# EAGLE design NV08C_GPS_shield_v1.1_reduced (EAGLE 6.4)
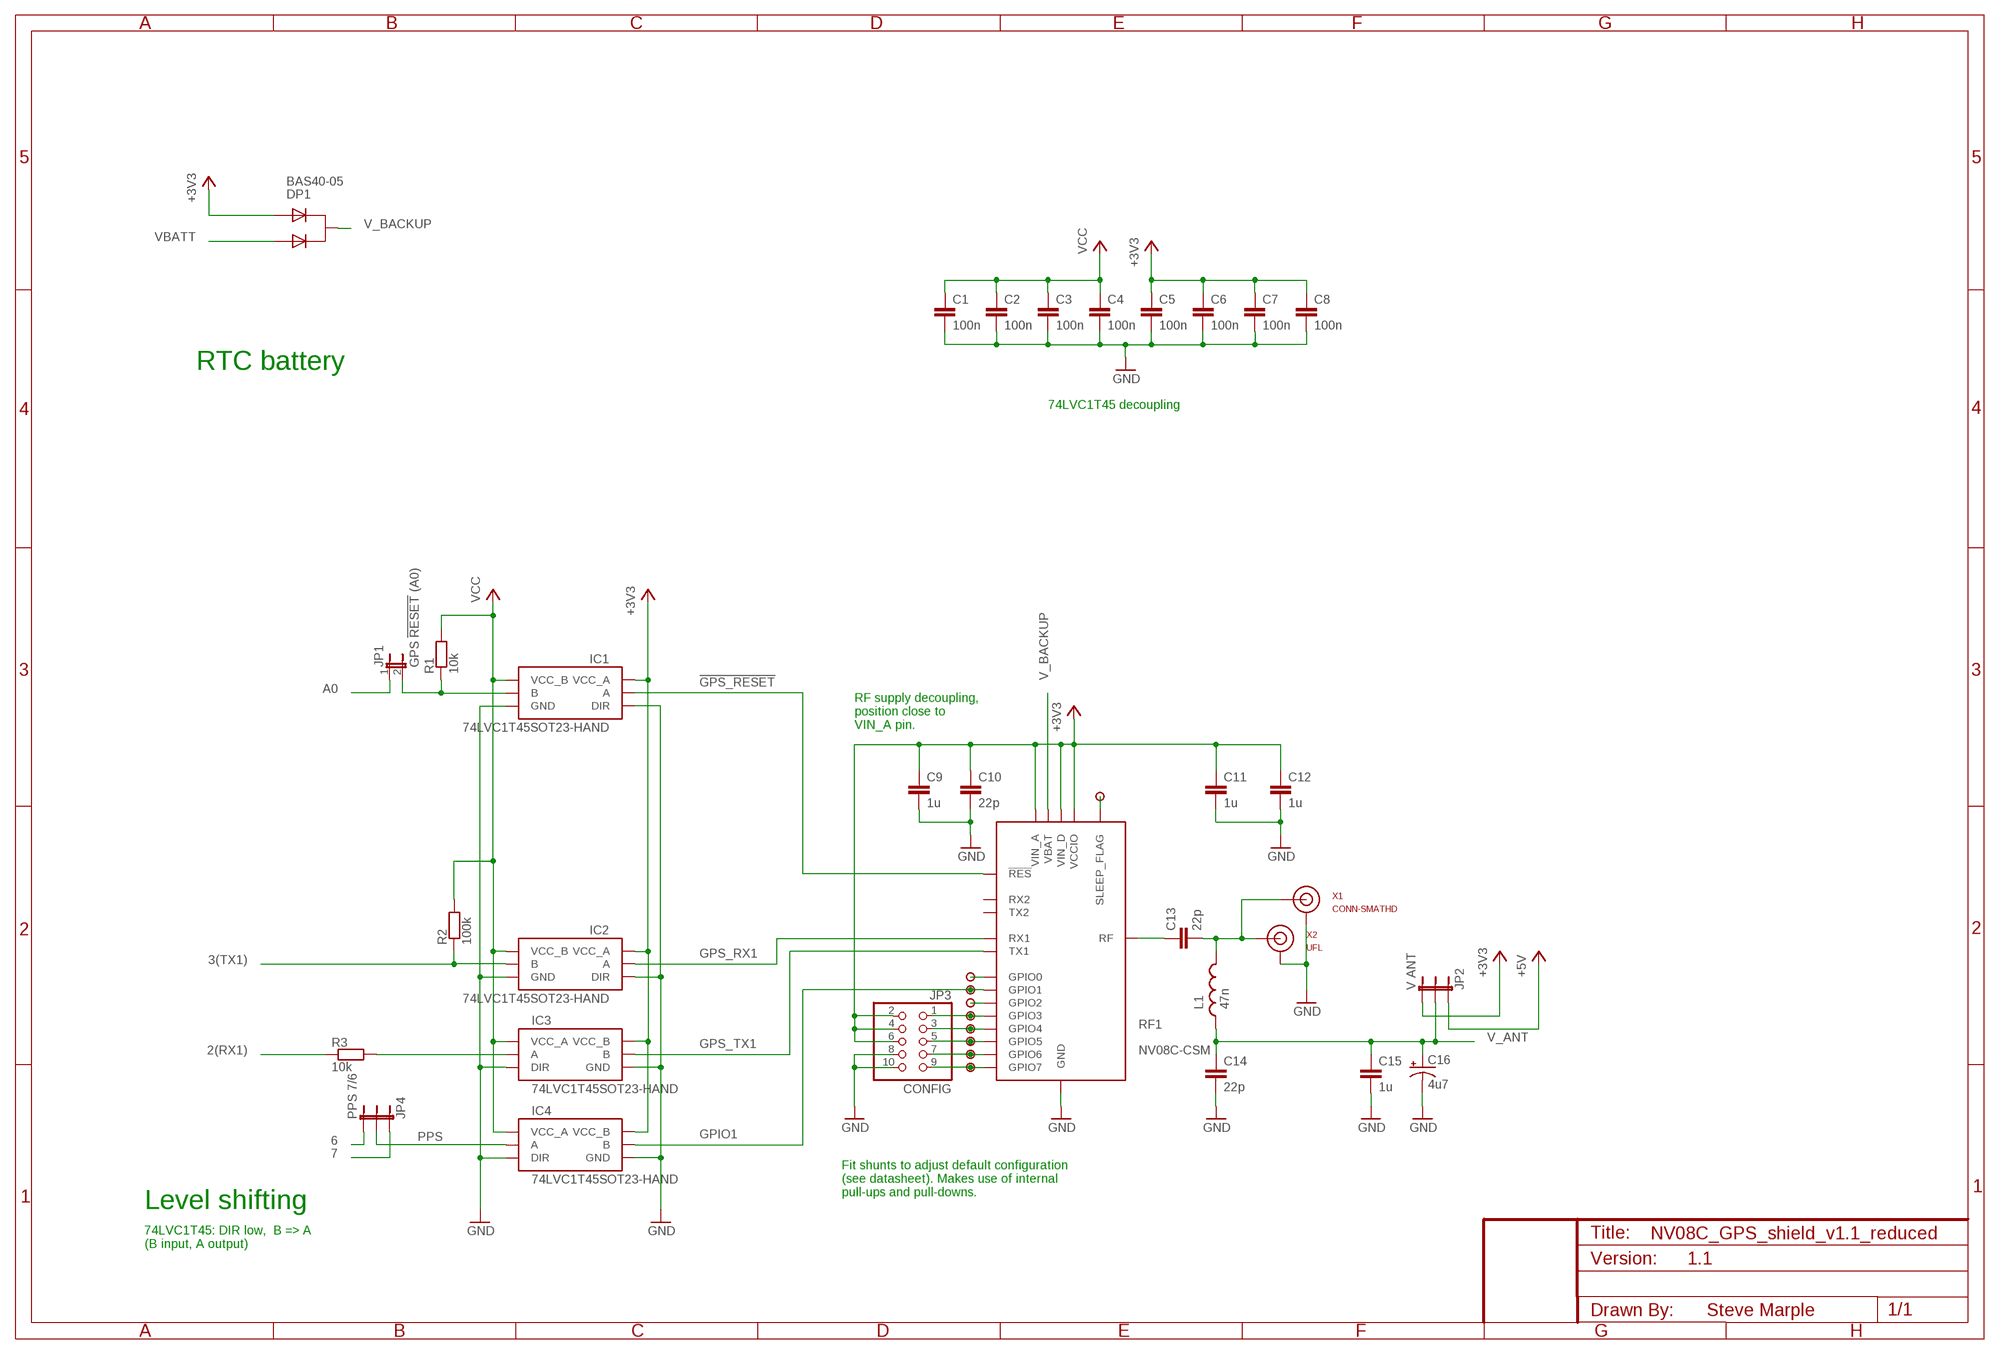
[diagram p0: schematic, sheet 1]

## Parts
C1  100n  C-EU1206-HAND  [1206-HAND]
C2  100n  C-EU1206-HAND  [1206-HAND]
C3  100n  C-EU1206-HAND  [1206-HAND]
C4  100n  C-EU1206-HAND  [1206-HAND]
C5  100n  C-EU1206-HAND  [1206-HAND]
C6  100n  C-EU1206-HAND  [1206-HAND]
C7  100n  C-EU1206-HAND  [1206-HAND]
C8  100n  C-EU1206-HAND  [1206-HAND]
C9  1u  C-EU1206-HAND  [1206-HAND]
C10  22p  C-EU0805-HAND  [0805-HAND]
C11  1u  C-EU1206-HAND  [1206-HAND]
C12  1u  C-EU1206-HAND  [1206-HAND]
C13  22p  C-EU0805-HAND  [0805-HAND]
C14  22p  C-EU0805-HAND  [0805-HAND]
C15  1u  C-EU1206-HAND  [1206-HAND]
C16  4u7  CAP_POLPTH2  [CPOL-RADIAL-10UF-25V]
DP1  BAS40-05  DIODE-PAIR-COMMON-CATHODE  [SOT23-3-HAND]
IC1  74LVC1T45SOT23-HAND  [SOT23-6-HAND]
IC2  74LVC1T45SOT23-HAND  [SOT23-6-HAND]
IC3  74LVC1T45SOT23-HAND  [SOT23-6-HAND]
IC4  74LVC1T45SOT23-HAND  [SOT23-6-HAND]
JP1  GPS !RESET! (A0)  JUMPER-2PTH  [1X02]
JP2  V ANT  JUMPER-3PTH  [1X03]
JP3  CONFIG  PINHD-2X5  [2X05]
JP4  PPS 7/6  JUMPER-3PTH  [1X03]
L1  47n  INDUCTOR0805-HAND  [0805-HAND]
R1  10k  RESISTOR1206-HAND  [1206-HAND]
R2  100k  RESISTOR1206-HAND  [1206-HAND]
R3  10k  RESISTOR1206-HAND  [1206-HAND]
RF1  NV08C-CSM  NV08C-CSMHAND  [NVC08C-CSM-HAND]
U$1  PAD  [PAD]
U$2  PAD  [PAD]
U$3  PAD  [PAD]
U$4  ?  PAD  [PAD]
U$5  PAD  [PAD]
U$6  PAD  [PAD]
U$7  PAD  [PAD]
U$8  PAD  [PAD]
U$9  PAD  [PAD]
X1  CONN-SMATHD  [SMA-THD]
X2  UFL  CONN-UFLHAND  [CONN-UFL-HAND-SOLDERING]

## Nets
2(RX1): R3.1
3(TX1): IC2.4(B) R2.1
6: JP4.3
7: JP4.1
!GPS_RESET: IC1.3(A) RF1.P$25(!RES)
+3V3 [power]: C5.1 C6.1 C7.1 C8.1 C9.1 C10.1 C11.1 C12.1 DP1.2(A2) IC1.1(VCC_A) IC2.1(VCC_A) IC3.6(VCC_B) IC4.6(VCC_B) JP2.3 JP3.2 JP3.4 JP3.6 RF1.P$8(VIN_A) RF1.P$26(VIN_D) RF1.P$28(VCCIO)
+5V [power]: JP2.1
A0: JP1.1
GND [power]: C1.2 C2.2 C3.2 C4.2 C5.2 C6.2 C7.2 C8.2 C9.2 C10.2 C11.2 C12.2 C14.2 C15.2 C16.2(-) IC1.2(GND) IC1.5(DIR) IC2.2(GND) IC2.5(DIR) IC3.2(GND) IC3.5(DIR) IC4.2(GND) IC4.5(DIR) JP3.8 JP3.10 RF1.P$3(GND) RF1.P$9(GND) RF1.P$10(GND) RF1.P$11(GND) RF1.P$12(GND) RF1.P$13(GND) RF1.P$14(GND) RF1.P$16(GND) RF1.P$17(GND) RF1.P$18(GND) RF1.P$19(GND) RF1.P$22(GND) RF1.P$24(GND) RF1.P$27(GND) RF1.P$29(GND) RF1.P$34(GND) X1.GND@0(GND) X1.GND@1(GND) X1.GND@2(GND) X1.GND@3(GND) X2.GND@0(GND) X2.GND@1(GND)
GPIO0: RF1.P$20(GPIO0) U$2.1
GPIO1: IC4.4(B) RF1.P$2(GPIO1) U$3.1
GPIO2: RF1.P$1(GPIO2) U$4.1
GPIO3: JP3.1 RF1.P$6(GPIO3) U$5.1
GPIO4: JP3.3 RF1.P$7(GPIO4) U$6.1
GPIO5: JP3.5 RF1.P$4(GPIO5) U$7.1
GPIO6: JP3.7 RF1.P$35(GPIO6) U$8.1
GPIO7: JP3.9 RF1.P$5(GPIO7) U$9.1
GPS_RX1: IC2.3(A) RF1.P$33(RX1)
GPS_TX1: IC3.4(B) RF1.P$32(TX1)
N$4 [antenna]: C13.2 L1.2 X1.SIG(SIGNAL) X2.SIGNAL
N$5: IC3.3(A) R3.2
N$7 [antenna]: C13.1 RF1.P$15(RF)
N$8: IC1.4(B) JP1.2 R1.1
PPS: IC4.3(A) JP4.2
SLEEP_FLAG: RF1.P$21(SLEEP_FLAG) U$1.1
V_ANT [power]: C14.1 C15.1 C16.1(+) JP2.2 L1.1
V_BACKUP: DP1.3(C) RF1.P$23(VBAT)
VBATT: DP1.1(A1)
VCC: C1.1 C2.1 C3.1 C4.1 IC1.6(VCC_B) IC2.6(VCC_B) IC3.1(VCC_A) IC4.1(VCC_A) R1.2 R2.2
Unconnected: RF1.P$30(RX2) RF1.P$31(TX2)

## Notes on the sheet
- RTC battery
- 74LVC1T45 decoupling
- RF supply decoupling,
  position close to
  VIN_A pin.
- Fit shunts to adjust default configuration
  (see datasheet). Makes use of internal
  pull-ups and pull-downs.
- Level shifting
- 74LVC1T45: DIR low,  B => A
  (B input, A output)
- 1.1
- Steve Marple

## Library data of the parts
C1-C15 = SteveMarple:C-EU
C16 = SteveMarple:CAP_POL: Capacitor Polarized These are standard SMD and PTH capacitors. Normally 10uF, 47uF, and 100uF in electrolytic and tantalum varieties. Always verify the external diameter of the through hole cap, it varies with capacity, voltage, and manufacturer. The EIA devices should be standard.
DP1 = SteveMarple:DIODE-PAIR-COMMON-CATHODE
IC1-IC4 = SteveMarple:74LVC1T45
JP1 = SparkFun:JUMPER-2: Jumper Basic 0.1" spaced jumper. Use with breakaway headers.
JP2 JP4 = SparkFun:JUMPER-3
JP3 = pinhead:PINHD-2X5: PIN HEADER
L1 = SteveMarple:INDUCTOR: Inductors Basic Inductor/Choke - 0603 and 1206. Footprints are not proven and vary greatly between part numbers.
R1-R3 = SteveMarple:RESISTOR: 1/4W PTH resistor
RF1 = nvs-tech:NV08C-CSM
U$1-U$9 = SteveMarple:PAD
X1 = SteveMarple:CONN-SMA: SMA connector
X2 = SteveMarple:CONN-UFL

## Net classes
1 power: width 0.381 mm
2 antenna: width 0.66 mm

## Board
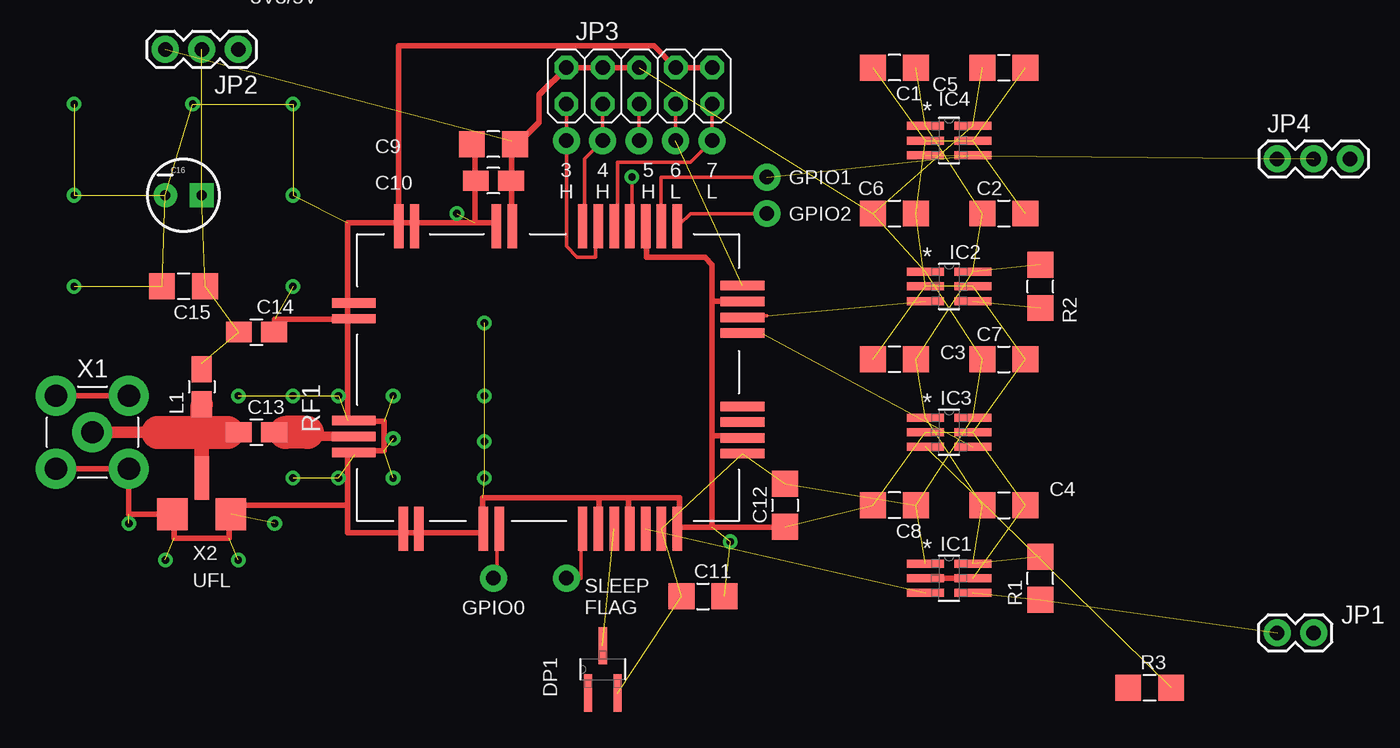
[diagram p1: board, top side]
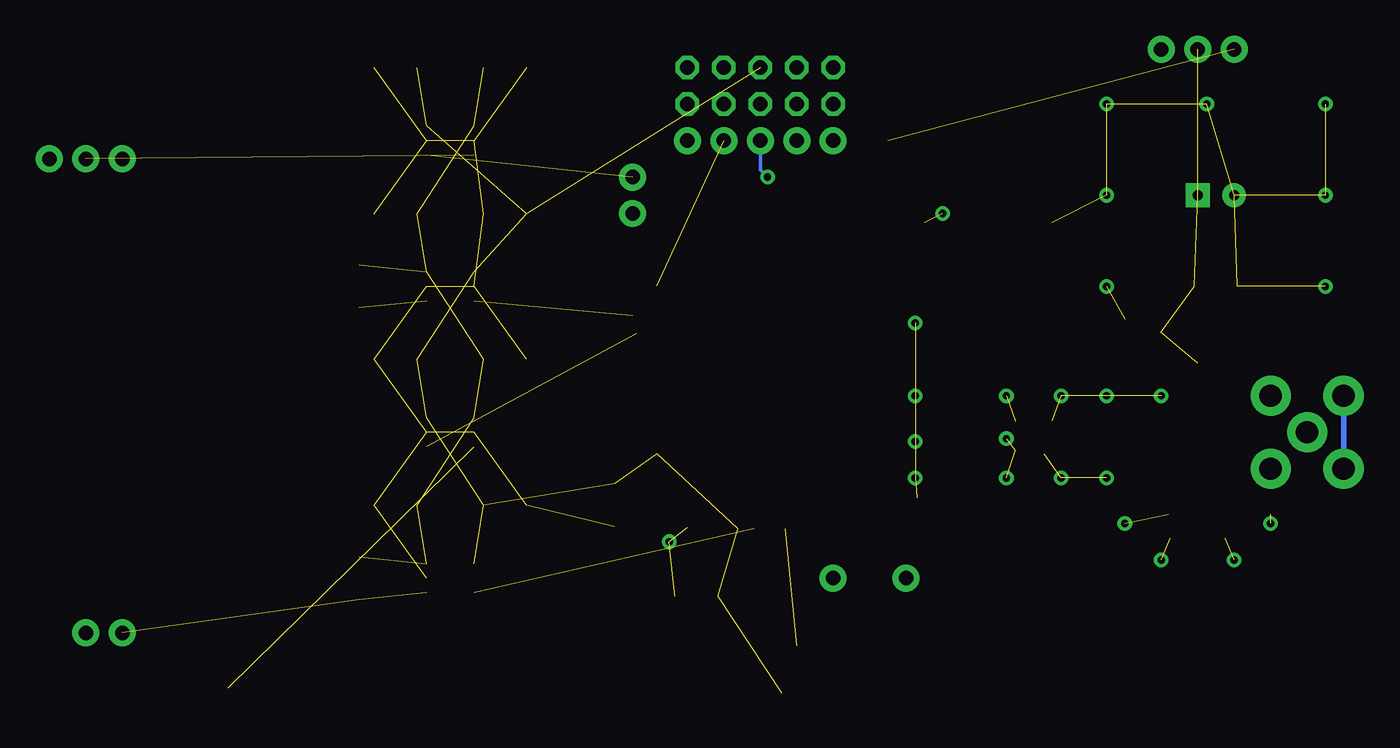
[diagram p2: board, bottom side, seen from below]

No outline drawn. Coordinates in mm, seen from the top.
Copper layers (1*16): Top 0.035mm / dielectric 1.5mm / Bottom 0.035mm
Design rules "SparkFun_Iteadstudio_10_12mil": minimum track width 10mil, minimum drill 20mil, track to track 12mil, track to pad 12mil, pad to pad 12mil, via to via 12mil, smd to smd 12mil, copper to edge 0.5mm, drill to drill 8mil, minimum pad ring 12mil, minimum via ring 10mil, stop-mask expansion 4mil, vias tented up to drill 25mil, thermal gap 10mil

### Footprints (pad centres in the part's own frame; a part is rotated, then mirrored left to right if it is on the bottom)
1206-HAND = smd 1.8 x 1.803: 1 -1.499,0; 2 1.499,0
0805-HAND = smd 1.8 x 1.4: 1 -1.225,0; 2 1.225,0
CPOL-RADIAL-10UF-25V = drill 0.7 pad 1.651 square: 1 1.27,0 | drill 0.7 pad 1.651: 2 -1.27,0
SOT23-3-HAND = smd 2.591 x 0.559: 1 -1.651,1.016; 2 -1.651,-1.016; 3 1.651,0
SOT23-6-HAND = smd 2.591 x 0.559: 1 -1.651,1.016; 2 -1.651,0; 3 -1.651,-1.016; 4 1.651,-1.016; 5 1.651,0; 6 1.651,1.016
1X02 = drill 1.016 pad 1.88: 1 0,0; 2 2.54,0
1X03 = drill 1.016 pad 1.88: 1 0,0; 2 2.54,0; 3 5.08,0
2X05 = drill 1.016 octagon: 1 -5.08,-1.27; 2 -5.08,1.27; 3 -2.54,-1.27; 4 -2.54,1.27; 5 0,-1.27; 6 0,1.27; 7 2.54,-1.27; 8 2.54,1.27; 9 5.08,-1.27; 10 5.08,1.27
NVC08C-CSM-HAND = smd 0.66 x 3.048: P$1 -9,-10.535; P$2 -7.9,-10.535; P$3 -6.8,-10.535; P$4 -5.7,-10.535; P$5 -4.6,-10.535; P$6 -3.5,-10.535; P$7 -2.4,-10.535; P$8 2.5,-10.535; P$9 3.6,-10.535; P$10 9.3,-10.535; P$11 10.4,-10.535; P$17 10.1,10.535; P$18 9,10.535; P$19 4.5,10.535; P$20 3.4,10.535; P$21 -2.4,10.535; P$22 -3.5,10.535; P$23 -4.6,10.535; P$24 -5.7,10.535; P$25 -6.8,10.535; P$26 -7.9,10.535; P$27 -9,10.535 | smd 3.048 x 0.66: P$12 13.535,-5.2; P$13 13.535,-4.1; P$14 13.535,3; P$15 13.535,4.1; P$16 13.535,5.2; P$28 -13.535,5.3; P$29 -13.535,4.2; P$30 -13.535,3.1; P$31 -13.535,2; P$32 -13.535,-3.1; P$33 -13.535,-4.2; P$34 -13.535,-5.3; P$35 -13.535,-6.4
PAD = drill 1.016 pad 1.88: 1 0,0
SMA-THD = drill 1.549 pad 2.794: GND@0 -2.54,2.54; GND@1 2.54,2.54; GND@2 2.54,-2.54; GND@3 -2.54,-2.54; SIG 0,0
CONN-UFL-HAND-SOLDERING = smd 2.134 x 2.235: GND@0 -2.032,0; GND@1 2.032,0 | smd 1.016 x 3.048: SIGNAL 0,-2.54

### Placement (x,y rotation side)
C1  60.96,45.72 180 top
C2  68.58,35.56 0 top
C3  60.96,25.4 180 top
C4  68.58,15.24 0 top
C5  68.58,45.72 0 top
C6  60.96,35.56 0 top
C7  68.58,25.4 0 top
C8  60.96,15.24 180 top
C9  33.02,40.39 180 top
C10  33.02,37.85 180 top
C11  47.62,8.89 0 top
C12  53.34,15.24 270 top
C13  16.51,20.32 180 top
C14  16.51,27.3 0 top
C15  11.43,30.48 180 top
C16  11.43,36.83 0 top
DP1  40.64,3.81 90 top
IC1  64.77,10.16 0 top
IC2  64.77,30.48 0 top
IC3  64.77,20.32 0 top
IC4  64.77,40.64 0 top
JP1  90.17,6.35 180 top
JP2  15.24,46.99 180 top
JP3  43.18,44.45 0 top
JP4  87.63,39.37 0 top
L1  12.7,23.5 270 top
R1  71.12,10.16 90 top
R2  71.12,30.48 90 top
R3  78.74,2.54 0 top
RF1  36.83,24.13 180 top
U$1  38.1,10.16 270 top
U$2  33.02,10.16 270 top
U$3  52.07,38.1 270 top
U$4  52.07,35.56 270 top
U$5  38.1,40.64 270 top
U$6  40.64,40.64 270 top
U$7  43.18,40.64 270 top
U$8  45.72,40.64 270 top
U$9  48.26,40.64 270 top
X1  5.08,20.32 270 top
X2  12.7,14.61 180 top

### Tracks (layer width: path | path; a pad name or v marks a point on that pad's centre or on a via)
3(TX1)  (1 unrouted)
!GPS_RESET  (1 unrouted)
+3V3  (14 unrouted)
  Top 0.381: JP3.6 JP3.4 JP3.2 36.2,43.81 36.2,41.91 34.92,40.64 34.8,40.89 34.54,40.64 C9.1 34.29,40.64 34.29,38.1 | 34.29,38.1 34.29,34.8 RF1.P$8 | 34.29,38.1 C10.1
GND  (via drill 0.51)  (43 unrouted)
  Top 0.381: X1.GND@0 X1.GND@3 | X1.GND@2 X1.GND@1 7.62,14.61 X2.GND@1 10.79,14.61 10.79,12.95 14.61,12.95 14.61,14.61 X2.GND@0 14.73,15.24 22.86,15.24 | 27.94,13.34 26.67,13.34 | 26.67,13.34 22.86,13.34 22.86,15.24 | 26.67,13.34 RF1.P$17 | 27.94,13.34 32.38,13.34 RF1.P$19 32.26,13.72 32.26,15.75 40.39,15.75 | 27.94,13.34 RF1.P$18 | 22.86,19.05 23.37,18.8 RF1.P$16 22.86,19.05 | C14.2 17.78,27.3 17.78,28.19 23.11,28.19 RF1.P$13 | RF1.P$13 22.86,28.23 22.86,21.13 RF1.P$14 23.37,21.08 25.4,21.08 25.4,19.05 22.86,19.05 | 22.86,29.21 22.86,28.45 RF1.P$13 | JP3.10 JP3.8 44.2,47.24 26.42,47.24 26.42,34.92 | RF1.P$9 33.02,34.92 31.75,34.92 | 31.75,34.92 27.69,34.92 RF1.P$10 27.43,34.92 26.67,34.92 RF1.P$11 26.42,34.92 | 22.86,29.21 22.86,34.92 26.42,34.92 | 22.86,29.21 RF1.P$12 | 22.86,19.05 22.86,15.24 | 48.26,29.46 50.29,29.46 RF1.P$34 | 48.26,20.07 48.26,29.46 | 48.26,20.07 50.29,20.07 RF1.P$29 | 48.26,29.46 48.26,32 47.75,32.51 43.69,32.51 43.69,34.54 RF1.P$3 | 48.51,8.89 C11.2 | IC1.2 IC1.5 | 40.39,15.75 40.39,13.72 RF1.P$22 | 42.42,15.75 40.39,15.75 | 42.42,15.75 42.42,13.72 RF1.P$24 | 45.97,13.72 48.26,13.72 | 48.26,13.72 53.34,13.72 C12.2 | 45.97,13.72 RF1.P$27 | 42.42,15.75 45.97,15.75 45.97,13.72 | 48.26,13.72 48.26,20.07 | 31.75,38.1 31.75,40.64 C9.2 | 31.75,34.92 31.75,38.1 | 31.75,38.1 C10.2
  Bottom 0.381: X1.GND@2 X1.GND@3
  other vias: 10.16,11.43 3.81,43.18 3.81,30.48 3.81,36.83 7.62,13.97 19.05,36.83 15.24,22.86 49.53,12.7 22.23,17.14 22.23,22.86 15.24,11.43 19.05,43.18 30.48,35.56 19.05,17.14 26.04,19.88 26.04,17.14 26.04,22.86 19.05,22.86 32.38,17.14 32.38,19.68 32.38,22.86 32.38,27.94 19.05,30.48 12.06,43.18 17.78,13.97
GPIO0
  Top 0.254: U$2.1 33.27,10.16 33.27,13.46 RF1.P$20
GPIO1  (1 unrouted)
  Top 0.254: U$3.1 44.7,38.1 44.7,34.8 RF1.P$2
GPIO2
  Top 0.254: U$4.1 46.74,35.56 45.97,34.8 RF1.P$1
GPIO3
  Top 0.254: RF1.P$6 40.13,34.54 40.13,32.51 38.86,32.51 38.1,33.27 U$5.1 JP3.1
GPIO4
  Top 0.254: RF1.P$7 39.37,34.8 39.37,39.37 U$6.1 JP3.3
GPIO5  (via drill 0.51)
  Top 0.254: v42.67,38.1 42.67,34.8 RF1.P$4 | U$7.1 JP3.5
  Bottom 0.254: v42.67,38.1 43.18,38.61 U$7.1
GPIO6  (1 unrouted)
  Top 0.254: U$8.1 JP3.7
GPIO7
  Top 0.254: RF1.P$5 41.66,34.8 41.66,39.12 46.74,39.12 U$9.1 JP3.9
GPS_RX1  (1 unrouted)
  Top 0.254: 52.07,28.45 50.55,28.45 RF1.P$33
GPS_TX1  (1 unrouted)
  Top 0.254: 51.82,27.18 50.55,27.18 RF1.P$32
N$4
  Top 0.762: 14.48,20.32 C13.2
  Top 0.813: X1.SIG 9.65,20.32
  Top 1.016: X2.SIGNAL 12.7,20.32
  Top 1.524: 12.7,20.32 L1.2
  Top 2.311: 9.65,20.32 12.7,20.32 14.48,20.32
N$5  (1 unrouted)
N$7
  Top 0.66: 20.07,20.32 20.32,20.03 RF1.P$15
  Top 0.762: 18.54,20.32 C13.1
  Top 2.311: 20.07,20.32 18.54,20.32
N$8  (2 unrouted)
PPS  (1 unrouted)
SLEEP_FLAG
  Top 0.254: U$1.1 39.12,10.16 39.12,13.46 RF1.P$21
V_ANT  (4 unrouted)
  Top 0.381: 12.7,25.15 L1.1
V_BACKUP  (1 unrouted)
VCC  (9 unrouted)

### Text on the board
tSilk: 3 / H | 4 / H | 5 / H | 6 / L | 7 / L | GPIO1 | GPIO2 | SLEEP / FLAG | GPIO0
_tsilk: 3V3/5V